# Altium project RAVEN 1.0.PrjPcb
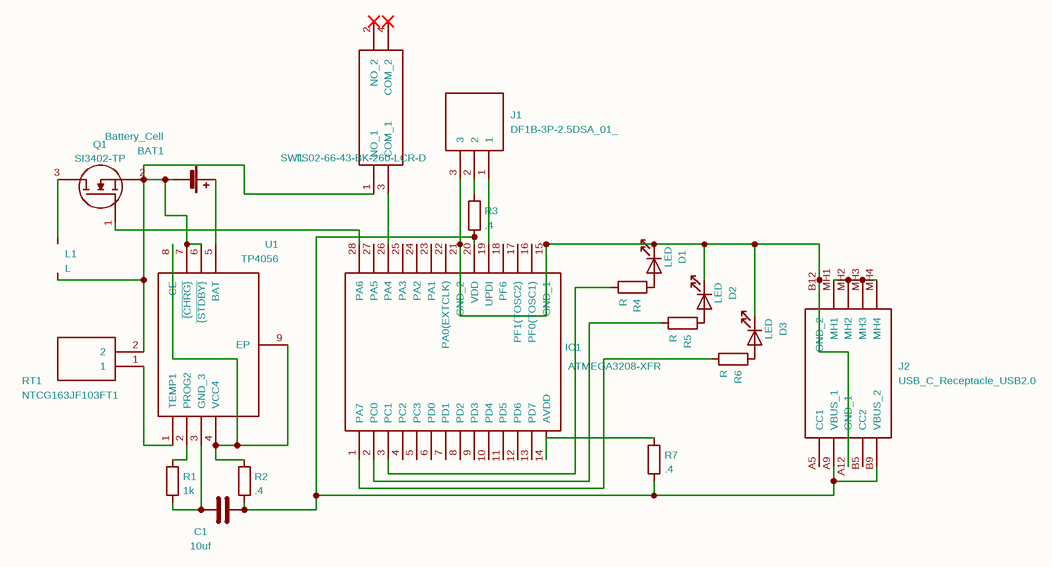
[diagram p0: RAVEN 1.0.SchDoc]
1 sheet, 20 parts. Net scope: global (net labels, ports and power ports of the same name join across sheets).
Board file: RAVEN 1.0.PcbDoc

## Sheet RAVEN 1.0.SchDoc
size 297 x 209 mm

### Parts
BAT1  Battery_Cell  [SolderWire-0.5sqmm_1x02_P4.6mm_D0.9mm_OD2.1mm]
C1  10uf  [C_0603_1608Metric_Pad1.08x0.95mm_HandSolder]
D1  LED  [LED_0603_1608Metric_Pad1.05x0.95mm_HandSolder]
D2  LED  [LED_0603_1608Metric_Pad1.05x0.95mm_HandSolder]
D3  LED  [LED_0603_1608Metric_Pad1.05x0.95mm_HandSolder]
IC1  ATMEGA3208-XFR  [SSOP-28_5.3x10.2mm_P0.65mm]
J1  DF1B-3P-2.5DSA_01_  [DF1B3P25DSA01]
J2  USB_C_Receptacle_USB2.0  [USB4125GFA0190]
L1  L  [SolderWire-0.5sqmm_1x02_P4.6mm_D0.9mm_OD2.1mm]
Q1  SI3402-TP  [SOT-23]
R1  1k  [R_0603_1608Metric_Pad0.98x0.95mm_HandSolder]
R2  .4  [R_0603_1608Metric_Pad0.98x0.95mm_HandSolder]
R3  .4  [R_0603_1608Metric_Pad0.98x0.95mm_HandSolder]
R4  R  [R_0603_1608Metric_Pad0.98x0.95mm_HandSolder]
R5  R  [R_0603_1608Metric_Pad0.98x0.95mm_HandSolder]
R6  R  [R_0603_1608Metric_Pad0.98x0.95mm_HandSolder]
R7  .4  [R_0603_1608Metric_Pad0.98x0.95mm_HandSolder]
RT1  NTCG163JF103FT1  [R_0603_1608Metric_Pad0.98x0.95mm_HandSolder]
SW1  TS02-66-43-BK-260-LCR-D  [TS026643BK260LCRD]
U1  TP4056  [HTSOP-8-1EP_3.9x4.9mm_P1.27mm_EP2.4x3.2mm]

### Nets
NetBAT1_1: BAT1.1(+) U1.5(BAT)
NetBAT1_2: BAT1.2(-) L1.2 Q1.2 RT1.2 SW1.1(NO_1) U1.6(~{{STDBY}}) U1.7(~{{CHRG}})
NetC1_1: C1.1 R1.2 U1.3(GND_3)
NetC1_2: C1.2 IC1.20(VDD) J2.A9(VBUS_1) J2.B9(VBUS_2) R2.2 R3.2 R7.2
NetD1_1: D1.1(K) D2.1(K) D3.1(K) IC1.15(GND_1) IC1.21(GND_2) J1.3 J2.A12(GND_1) J2.B12(GND_2)
NetD1_2: D1.2(A) R4.1
NetD2_2: D2.2(A) R5.1
NetD3_2: D3.2(A) R6.1
NetIC1_1: IC1.1(PA7) R6.2
NetIC1_2: IC1.2(PC0) R5.2
NetIC1_3: IC1.3(PC1) R4.2
NetIC1_14: IC1.14(AVDD) R7.1
NetIC1_19: IC1.19(UPDI) J1.1
NetIC1_26: IC1.26(PA4) SW1.3(COM_1)
NetIC1_28: IC1.28(PA6) Q1.1
NetJ1_2: J1.2 R3.1
NetJ2_MH1: J2.MH1 J2.MH2 J2.MH3 J2.MH4
NetL1_1: L1.1 Q1.3
NetR1_1: R1.1 U1.2(PROG2)
NetR2_1: R2.1 U1.4(VCC4) U1.8(CE) U1.9(EP)
NetRT1_1: RT1.1 U1.1(TEMP1)

Not connected (* = marked no-connect by the designer): IC1 4(PC2) 5(PC3) 6(PD0) 7(PD1) 8(PD2) 9(PD3) 10(PD4) 11(PD5) 12(PD6) 13(PD7) 16(PF0(TOSC1)) 17(PF1(TOSC2)) 18(PF6) 22(PA0(EXTCLK)) 23(PA1) 24(PA2) 25(PA3) 27(PA5); J2 A5(CC1) B5(CC2); SW1 2(NO_2)* 4(COM_2)*

### Notes on the sheet
- 1
- 2
- 3
- 4
- 5
- 6
- A
- B
- C
- D
- Title:
- File: RAVEN 1.0.kicad_sch
- Sheet: /
- KiCad E.D.A.  kicad (5.1.4)-1
- Size: A4
- Date:
- Rev:
- Id: 1/1

### Library data of the parts
C1 = C: Value: 10uf; Footprint: Capacitor_SMD:C_0603_1608Metric_Pad1.08x0.95mm_HandSolder
IC1 = ATMEGA3208-XFR: Manufacturer_Name: Microchip; Description: 8-bit Microcontrollers - MCU 20MHz, 32KB, SSOP28, Ind 125C, Green, T&R; Height: 1.99; Manufacturer_Part_Number: ATMEGA3208-XFR; Mouser Part Number: 556-ATMEGA3208-XFR; Mouser Price/Stock: https://www.mouser.co.uk/ProductDetail/Microchip-Technology/ATMEGA3208-XFR?qs=y6ZabgHbY%252ByexExRqReahg%3D%3D; Value: ATMEGA3208-XFR; Footprint: Package_SO:SSOP-28_5.3x10.2mm_P0.65mm
J1 = DF1B-3P-2.5DSA_01_: Manufacturer_Name: Hirose; Manufacturer_Part_Number: DF1B-3P-2.5DSA(01); Description: Headers & Wire Housings 2.5MM V SNG ROW HDR 3P THRU-HOLE GOLD; Height: 9.7; Mouser Part Number: 798-DF1B-3P-2.5DSA01; Mouser Price/Stock: https://www.mouser.co.uk/ProductDetail/Hirose-Connector/DF1B-3P-25DSA01?qs=zOgoZG1CgI%2F0mpGhbvQnew%3D%3D; Arrow Part Number: DF1B-3P-2.5DSA(01); Arrow Price/Stock: https://www.arrow.com/en/products/df1b-3p-2.5dsa-01/hirose-electric; Value: DF1B-3P-2.5DSA_01_
J2 = USB4125-GF-A-0190: Manufacturer_Name: GCT (GLOBAL CONNECTOR TECHNOLOGY); Description: USB Connectors USB C Rec GF RA 6P SMT TH Stakes 1.9mm; Height: 3.41; Manufacturer_Part_Number: USB4125-GF-A-0190; Mouser Part Number: 640-USB4125-GF-A-190; Mouser Price/Stock: https://www.mouser.co.uk/ProductDetail/GCT/USB4125-GF-A-0190?qs=QNEnbhJQKvbCz4hEJBS24w%3D%3D; Value: USB_C_Receptacle_USB2.0; Footprint: SamacSys_Parts:USB4125GFA0190
Q1 = SI3402-TP: Manufacturer_Name: Micro Commercial Components (MCC); Description: MOSFET 30V,4A,N-CHANNEL MOSFET,SOT-23; Height: 1.22; Manufacturer_Part_Number: SI3402-TP; Mouser Part Number: 833-SI3402-TP; Mouser Price/Stock: https://www.mouser.co.uk/ProductDetail/Micro-Commercial-Components-MCC/SI3402-TP?qs=y6ZabgHbY%252Bz%252BbnROIOEOVg%3D%3D; Arrow Part Number: SI3402-TP; Arrow Price/Stock: https://www.arrow.com/en/products/si3402-tp/micro-commercial-components?region=europe; Value: SI3402-TP; Footprint: Package_TO_SOT_SMD:SOT-23
R1-R3 R7 = R: Footprint: Resistor_SMD:R_0603_1608Metric_Pad0.98x0.95mm_HandSolder
  R1: Value: 1k
  R2 R3 R7: Value: .4
RT1 = NTCG163JF103FT1: Manufacturer_Name: TDK; Description: Chip NTC Thermistors (Sensor), Resistance (at 25?C)=10k?, Resistance Tolerance (at 25?C)=?1%; Height: 0.9; Manufacturer_Part_Number: NTCG163JF103FT1; Mouser Part Number: 810-NTCG163JF103FT1; Mouser Price/Stock: https://www.mouser.co.uk/ProductDetail/TDK/NTCG163JF103FT1?qs=f0gCvUGw%252BIyUP%2FT8hD9VGA%3D%3D; Arrow Part Number: NTCG163JF103FT1; Arrow Price/Stock: https://www.arrow.com/en/products/ntcg163jf103ft1/tdk?region=nac; Value: NTCG163JF103FT1; Footprint: Resistor_SMD:R_0603_1608Metric_Pad0.98x0.95mm_HandSolder
SW1 = TS02-66-43-BK-260-LCR-D: Manufacturer_Name: CUI Inc.; Description: Tactile Switches 6 x 6 mm, 4.3 mm Act Height, 260 gf, Black, Long Crimped, Through Hole, SPST,; Height: 4.5; Manufacturer_Part_Number: TS02-66-43-BK-260-LCR-D; Mouser Part Number: 179-TS026643BK260LCR; Mouser Price/Stock: https://www.mouser.co.uk/ProductDetail/CUI-Devices/TS02-66-43-BK-260-LCR-D?qs=A6eO%252BMLsxmQi%252BNuzcShOvg%3D%3D; Arrow Part Number: TS02-66-43-BK-260-LCR-D; Arrow Price/Stock: https://www.arrow.com/en/products/ts02-66-43-bk-260-lcr-d/cui-devices?region=nac; Value: TS02-66-43-BK-260-LCR-D
U1 = TP4056: Manufacturer_Name: NanJing Top Power; Description: 1A Standalone Linear Li-lon Battery Charger, SOP-8; Height: 1.75; Manufacturer_Part_Number: TP4056; Value: TP4056; Footprint: Package_SO:HTSOP-8-1EP_3.9x4.9mm_P1.27mm_EP2.4x3.2mm
BAT1 = Battery_Cell: Value: Battery_Cell; Footprint: Connector_Wire:SolderWire-0.5sqmm_1x02_P4.6mm_D0.9mm_OD2.1mm
D1-D3 = LED: Value: LED; Footprint: LED_SMD:LED_0603_1608Metric_Pad1.05x0.95mm_HandSolder
L1 = L: Value: L; Footprint: Connector_Wire:SolderWire-0.5sqmm_1x02_P4.6mm_D0.9mm_OD2.1mm
R4-R6 = R: Value: R; Footprint: Resistor_SMD:R_0603_1608Metric_Pad0.98x0.95mm_HandSolder